# Altium schematic sheet FPGA_bank34_35.SchDoc
size 420 x 297 mm
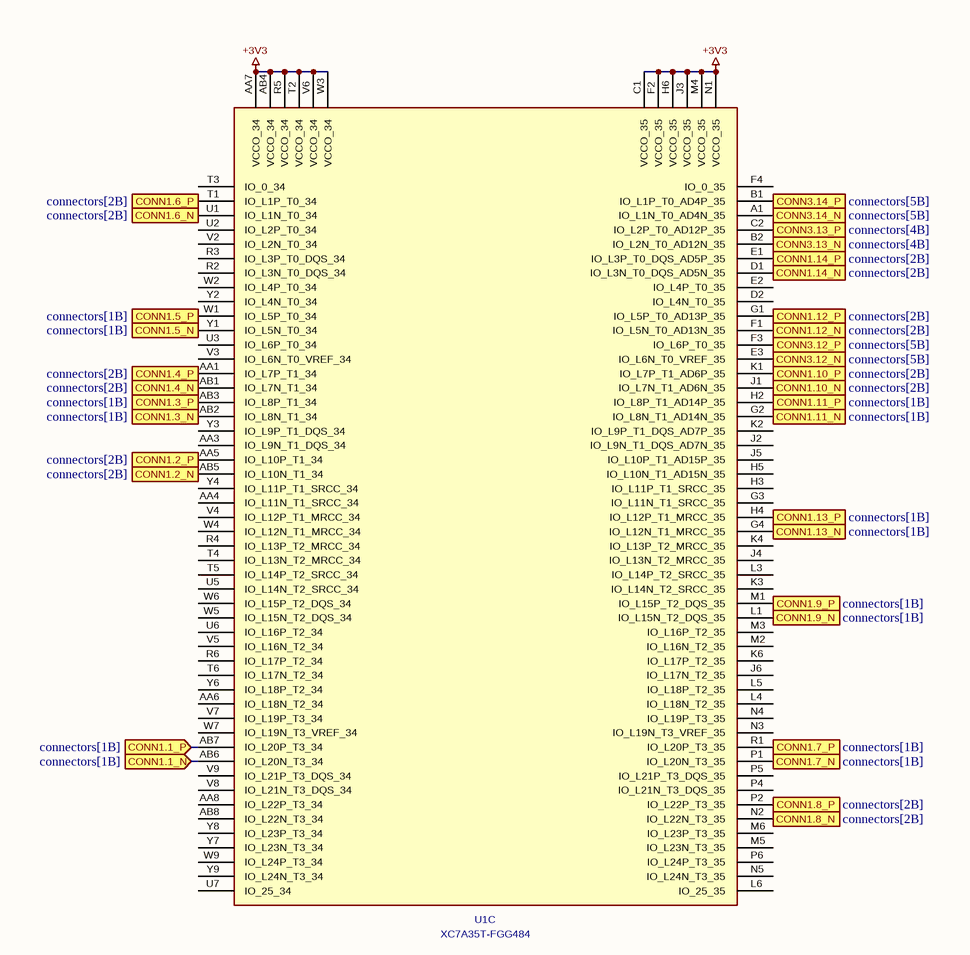
[diagram p0: FPGA_bank34_35.SchDoc]

## Parts
U1  XC7A35T-FGG484  [FB-BGA-484_23.0x23.0mm_Layout22x22_P1.0mm]  (part C of 7)

## Ports
CONN1.1_N (in, see connectors[1B]), CONN1.1_P (in, see connectors[1B]), CONN1.2_N (in, see connectors[2B]), CONN1.2_P (in, see connectors[2B]), CONN1.3_N (in, see connectors[1B]), CONN1.3_P (in, see connectors[1B]), CONN1.4_N (in, see connectors[2B]), CONN1.4_P (in, see connectors[2B]), CONN1.5_N (in, see connectors[1B]), CONN1.5_P (in, see connectors[1B]), CONN1.6_N (in, see connectors[2B]), CONN1.6_P (in, see connectors[2B]), CONN1.7_N (in, see connectors[1B]), CONN1.7_P (in, see connectors[1B]), CONN1.8_N (in, see connectors[2B]), CONN1.8_P (in, see connectors[2B]), CONN1.9_N (in, see connectors[1B]), CONN1.9_P (in, see connectors[1B]), CONN1.10_N (in, see connectors[2B]), CONN1.10_P (in, see connectors[2B]), CONN1.11_N (in, see connectors[1B]), CONN1.11_P (in, see connectors[1B]), CONN1.12_N (in, see connectors[2B]), CONN1.12_P (in, see connectors[2B]), CONN1.13_N (in, see connectors[1B]), CONN1.13_P (in, see connectors[1B]), CONN1.14_N (in, see connectors[2B]), CONN1.14_P (in, see connectors[2B]), CONN3.12_N (in, see connectors[5B]), CONN3.12_P (in, see connectors[5B]), CONN3.13_N (in, see connectors[4B]), CONN3.13_P (in, see connectors[4B]), CONN3.14_N (in, see connectors[5B]), CONN3.14_P (in, see connectors[5B])

## Nets
+3V3: U1.AA7(VCCO_34) U1.AB4(VCCO_34) U1.C1(VCCO_35) U1.F2(VCCO_35) U1.H6(VCCO_35) U1.J3(VCCO_35) U1.M4(VCCO_35) U1.N1(VCCO_35) U1.R5(VCCO_34) U1.T2(VCCO_34) U1.V6(VCCO_34) U1.W3(VCCO_34)
CONN1.1_N: U1.AB6(IO_L20N_T3_34) ; port CONN1.1_N
CONN1.1_P: U1.AB7(IO_L20P_T3_34) ; port CONN1.1_P
CONN1.2_N: U1.AB5(IO_L10N_T1_34) ; port CONN1.2_N
CONN1.2_P: U1.AA5(IO_L10P_T1_34) ; port CONN1.2_P
CONN1.3_N: U1.AB2(IO_L8N_T1_34) ; port CONN1.3_N
CONN1.3_P: U1.AB3(IO_L8P_T1_34) ; port CONN1.3_P
CONN1.4_N: U1.AB1(IO_L7N_T1_34) ; port CONN1.4_N
CONN1.4_P: U1.AA1(IO_L7P_T1_34) ; port CONN1.4_P
CONN1.5_N: U1.Y1(IO_L5N_T0_34) ; port CONN1.5_N
CONN1.5_P: U1.W1(IO_L5P_T0_34) ; port CONN1.5_P
CONN1.6_N: U1.U1(IO_L1N_T0_34) ; port CONN1.6_N
CONN1.6_P: U1.T1(IO_L1P_T0_34) ; port CONN1.6_P
CONN1.7_N: U1.P1(IO_L20N_T3_35) ; port CONN1.7_N
CONN1.7_P: U1.R1(IO_L20P_T3_35) ; port CONN1.7_P
CONN1.8_N: U1.N2(IO_L22N_T3_35) ; port CONN1.8_N
CONN1.8_P: U1.P2(IO_L22P_T3_35) ; port CONN1.8_P
CONN1.9_N: U1.L1(IO_L15N_T2_DQS_35) ; port CONN1.9_N
CONN1.9_P: U1.M1(IO_L15P_T2_DQS_35) ; port CONN1.9_P
CONN1.10_N: U1.J1(IO_L7N_T1_AD6N_35) ; port CONN1.10_N
CONN1.10_P: U1.K1(IO_L7P_T1_AD6P_35) ; port CONN1.10_P
CONN1.11_N: U1.G2(IO_L8N_T1_AD14N_35) ; port CONN1.11_N
CONN1.11_P: U1.H2(IO_L8P_T1_AD14P_35) ; port CONN1.11_P
CONN1.12_N: U1.F1(IO_L5N_T0_AD13N_35) ; port CONN1.12_N
CONN1.12_P: U1.G1(IO_L5P_T0_AD13P_35) ; port CONN1.12_P
CONN1.13_N: U1.G4(IO_L12N_T1_MRCC_35) ; port CONN1.13_N
CONN1.13_P: U1.H4(IO_L12P_T1_MRCC_35) ; port CONN1.13_P
CONN1.14_N: U1.D1(IO_L3N_T0_DQS_AD5N_35) ; port CONN1.14_N
CONN1.14_P: U1.E1(IO_L3P_T0_DQS_AD5P_35) ; port CONN1.14_P
CONN3.12_N: U1.E3(IO_L6N_T0_VREF_35) ; port CONN3.12_N
CONN3.12_P: U1.F3(IO_L6P_T0_35) ; port CONN3.12_P
CONN3.13_N: U1.B2(IO_L2N_T0_AD12N_35) ; port CONN3.13_N
CONN3.13_P: U1.C2(IO_L2P_T0_AD12P_35) ; port CONN3.13_P
CONN3.14_N: U1.A1(IO_L1N_T0_AD4N_35) ; port CONN3.14_N
CONN3.14_P: U1.B1(IO_L1P_T0_AD4P_35) ; port CONN3.14_P

Not connected (* = marked no-connect by the designer): U1 AA3(IO_L9N_T1_DQS_34) AA4(IO_L11N_T1_SRCC_34) AA6(IO_L18N_T2_34) AA8(IO_L22P_T3_34) AB8(IO_L22N_T3_34) D2(IO_L4N_T0_35) E2(IO_L4P_T0_35) F4(IO_0_35) G3(IO_L11N_T1_SRCC_35) H3(IO_L11P_T1_SRCC_35) H5(IO_L10N_T1_AD15N_35) J2(IO_L9N_T1_DQS_AD7N_35) J4(IO_L13N_T2_MRCC_35) J5(IO_L10P_T1_AD15P_35) J6(IO_L17N_T2_35) K2(IO_L9P_T1_DQS_AD7P_35) K3(IO_L14N_T2_SRCC_35) K4(IO_L13P_T2_MRCC_35) K6(IO_L17P_T2_35) L3(IO_L14P_T2_SRCC_35) L4(IO_L18N_T2_35) L5(IO_L18P_T2_35) L6(IO_25_35) M2(IO_L16N_T2_35) M3(IO_L16P_T2_35) M5(IO_L23N_T3_35) M6(IO_L23P_T3_35) N3(IO_L19N_T3_VREF_35) N4(IO_L19P_T3_35) N5(IO_L24N_T3_35) P4(IO_L21N_T3_DQS_35) P5(IO_L21P_T3_DQS_35) P6(IO_L24P_T3_35) R2(IO_L3N_T0_DQS_34) R3(IO_L3P_T0_DQS_34) R4(IO_L13P_T2_MRCC_34) R6(IO_L17P_T2_34) T3(IO_0_34) T4(IO_L13N_T2_MRCC_34) T5(IO_L14P_T2_SRCC_34) T6(IO_L17N_T2_34) U2(IO_L2P_T0_34) U3(IO_L6P_T0_34) U5(IO_L14N_T2_SRCC_34) U6(IO_L16P_T2_34) U7(IO_25_34) V2(IO_L2N_T0_34) V3(IO_L6N_T0_VREF_34) V4(IO_L12P_T1_MRCC_34) V5(IO_L16N_T2_34) V7(IO_L19P_T3_34) V8(IO_L21N_T3_DQS_34) V9(IO_L21P_T3_DQS_34) W2(IO_L4P_T0_34) W4(IO_L12N_T1_MRCC_34) W5(IO_L15N_T2_DQS_34) W6(IO_L15P_T2_DQS_34) W7(IO_L19N_T3_VREF_34) W9(IO_L24P_T3_34) Y2(IO_L4N_T0_34) Y3(IO_L9P_T1_DQS_34) Y4(IO_L11P_T1_SRCC_34) Y6(IO_L18P_T2_34) Y7(IO_L23N_T3_34) Y8(IO_L23P_T3_34) Y9(IO_L24N_T3_34)

## Notes on the sheet
- 1
- 2
- 3
- 4
- 5
- 6
- 7
- 8
- A
- B
- C
- D
- E
- Title:
- File: FPGA_bank34_35.kicad_sch
- Sheet: /
- F
- KiCad E.D.A.  kicad (5.1.4)-1
- Size: A3
- Date:
- Rev:
- Id: 1/1

## Library data of the parts
U1 = XC7A35T-FGG484: Value: XC7A35T-FGG484; Footprint: Package_BGA:FB-BGA-484_23.0x23.0mm_Layout22x22_P1.0mm